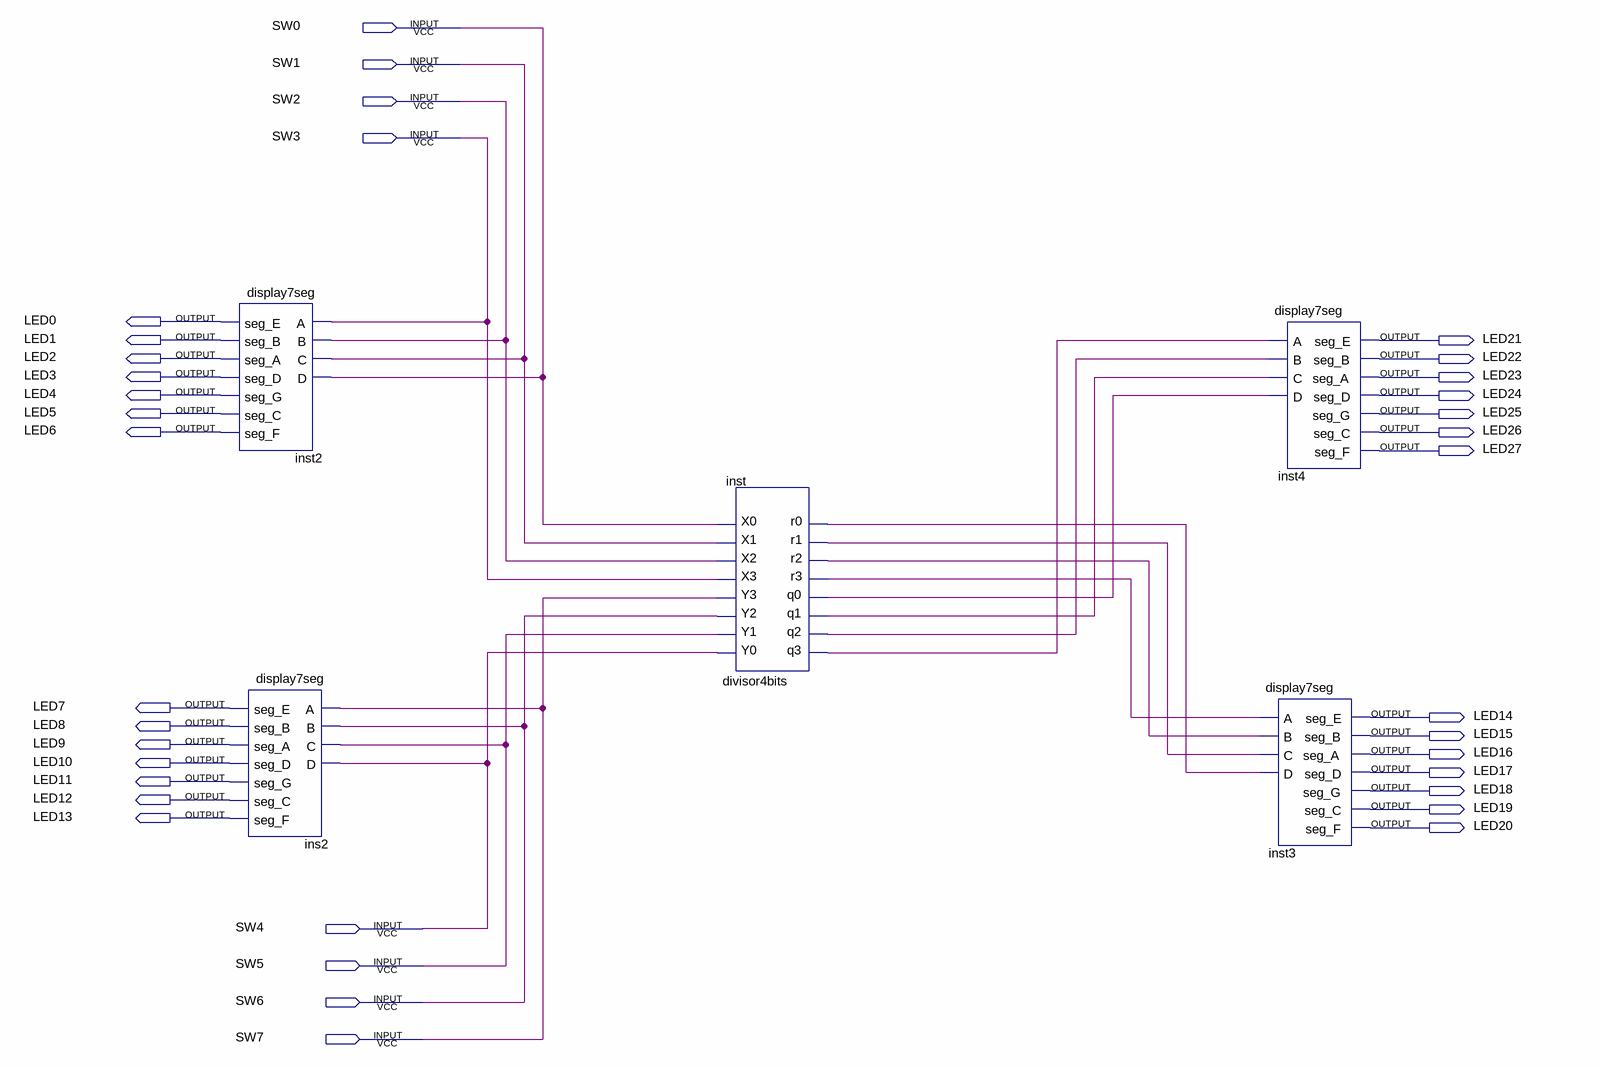
[diagram p0: schematic sheet]
// Quartus schematic divisor_enviar.bdf as structural Verilog: 5 symbols, 36 pins
module divisor_enviar (
  input  SW0,
  input  SW1,
  input  SW2,
  input  SW3,
  input  SW4,
  input  SW5,
  input  SW6,
  input  SW7,
  output LED0,
  output LED1,
  output LED21,
  output LED2,
  output LED22,
  output LED3,
  output LED23,
  output LED4,
  output LED24,
  output LED5,
  output LED25,
  output LED6,
  output LED26,
  output LED27,
  output LED7,
  output LED14,
  output LED8,
  output LED15,
  output LED9,
  output LED16,
  output LED10,
  output LED17,
  output LED11,
  output LED18,
  output LED12,
  output LED19,
  output LED13,
  output LED20
);

  wire inst_q0, inst_q1, inst_q2, inst_q3, inst_r0, inst_r1, inst_r2, inst_r3;

  display7seg inst2 (
    .A(SW3), .B(SW2), .C(SW1), .D(SW0), .seg_E(LED0), .seg_B(LED1), .seg_A(LED2), .seg_D(LED3), .seg_G(LED4),
    .seg_C(LED5), .seg_F(LED6));
  display7seg ins2 (
    .A(SW7), .B(SW6), .C(SW5), .D(SW4), .seg_E(LED7), .seg_B(LED8), .seg_A(LED9), .seg_D(LED10),
    .seg_G(LED11), .seg_C(LED12), .seg_F(LED13));
  divisor4bits inst (
    .Y0(SW4), .Y1(SW5), .Y2(SW6), .Y3(SW7), .X3(SW3), .X2(SW2), .X1(SW1), .X0(SW0), .q3(inst_q3),
    .q2(inst_q2), .q1(inst_q1), .q0(inst_q0), .r3(inst_r3), .r2(inst_r2), .r1(inst_r1), .r0(inst_r0));
  display7seg inst4 (
    .A(inst_q3), .B(inst_q2), .C(inst_q1), .D(inst_q0), .seg_E(LED21), .seg_B(LED22), .seg_A(LED23),
    .seg_D(LED24), .seg_G(LED25), .seg_C(LED26), .seg_F(LED27));
  display7seg inst3 (
    .A(inst_r3), .B(inst_r2), .C(inst_r1), .D(inst_r0), .seg_E(LED14), .seg_B(LED15), .seg_A(LED16),
    .seg_D(LED17), .seg_G(LED18), .seg_C(LED19), .seg_F(LED20));
endmodule
